# EAGLE schematic n64-usb (EAGLE 5.09)
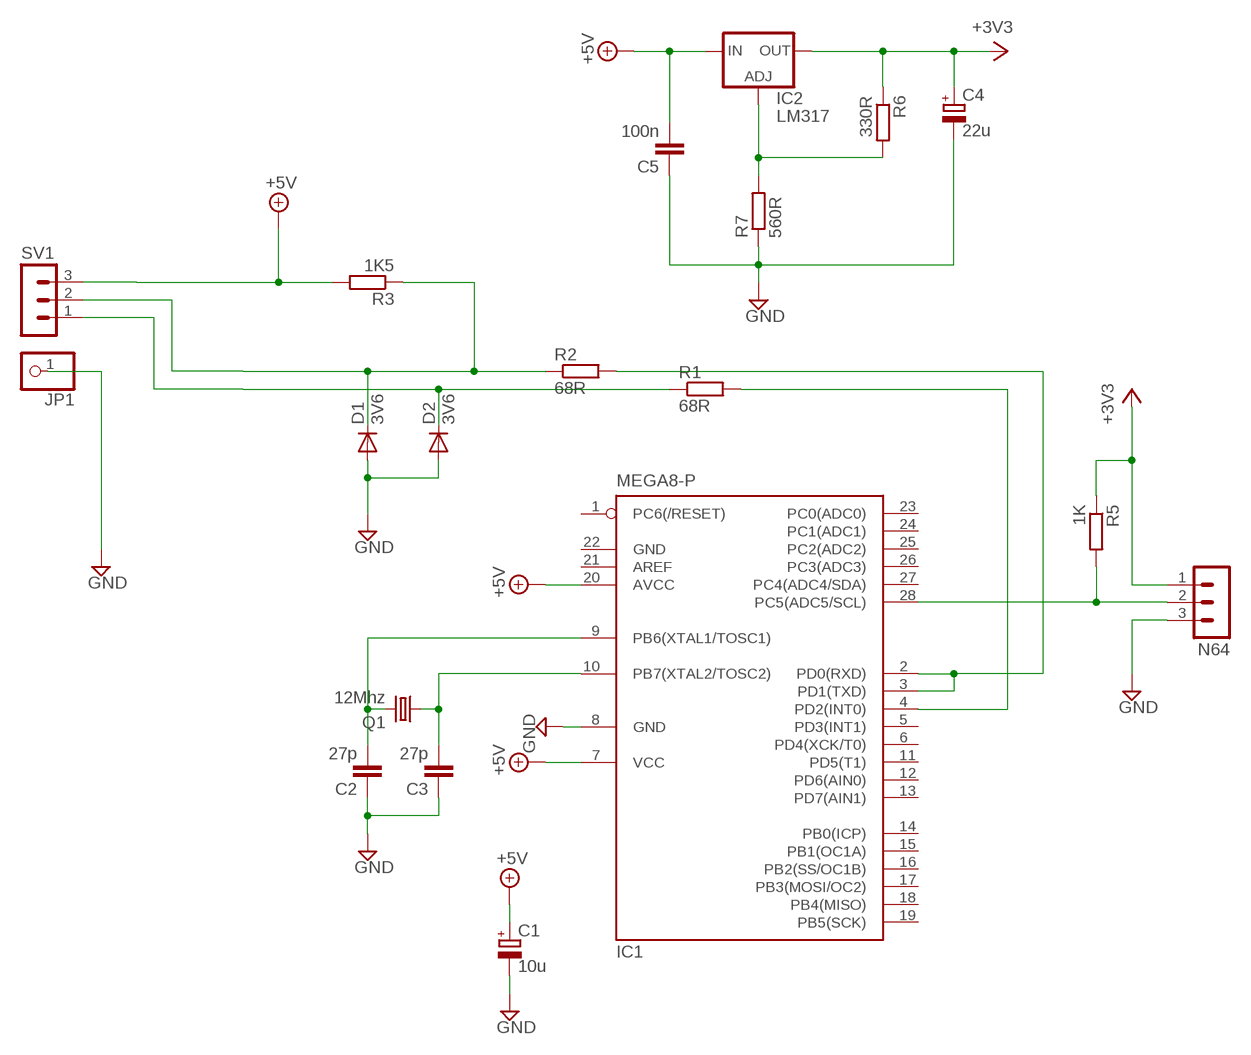
[diagram p0: schematic, sheet 1]

## Parts
C1  10u  CPOL-EUE2.5-6  [E2,5-6]
C2  27p  C-EU025-025X050  [C025-025X050]
C3  27p  C-EU025-025X050  [C025-025X050]
C4  22u  CPOL-EUE2.5-6  [E2,5-6]
C5  100n  C-EU025-025X050  [C025-025X050]
D1  3V6  1N4148DO35-10  [DO35-10]
D2  3V6  1N4148DO35-10  [DO35-10]
IC1  MEGA8-P  [DIL28-3]
IC2  LM317  LM317L  [317L]
JP1  PINHD-1X1  [1X01]
N64  MA03-1  [MA03-1]
Q1  12Mhz  CRYSTALHC49U-V  [HC49U-V]
R1  68R  R-EU_0207/2V  [0207/2V]
R2  68R  R-EU_0207/5V  [0207/5V]
R3  1K5  R-EU_0207/2V  [0207/2V]
R5  1K  R-EU_0207/2V  [0207/2V]
R6  330R  R-EU_0207/2V  [0207/2V]
R7  560R  R-EU_0207/2V  [0207/2V]
SV1  MA03-1  [MA03-1]

## Nets
+3V3: C4.+ IC2.2(OUT) N64.1 R5.1 R6.1
+5V: C1.+ C5.2 IC1.7(VCC) IC1.20(AVCC) IC2.3(IN) R3.2 SV1.3
GND: C1.- C2.1 C3.1 C4.- C5.1 D1.A D2.A IC1.8(GND) JP1.1 N64.3 R7.1
N$1: C3.2 IC1.10(PB7(XTAL2/TOSC2)) Q1.1
N$2: C2.2 IC1.9(PB6(XTAL1/TOSC1)) Q1.2
N$3: IC1.28(PC5(ADC5/SCL)) N64.2 R5.2
N$4: IC1.4(PD2(INT0)) R1.2
N$6: IC1.2(PD0(RXD)) IC1.3(PD1(TXD)) R2.2
N$8: D2.C R1.1 SV1.1
N$9: D1.C R2.1 R3.1 SV1.2
N$11: IC2.1(ADJ) R6.2 R7.2
Unconnected: IC1.1(PC6(/RESET)) IC1.5(PD3(INT1)) IC1.6(PD4(XCK/T0)) IC1.11(PD5(T1)) IC1.12(PD6(AIN0)) IC1.13(PD7(AIN1)) IC1.14(PB0(ICP)) IC1.15(PB1(OC1A)) IC1.16(PB2(SS/OC1B)) IC1.17(PB3(MOSI/OC2)) IC1.18(PB4(MISO)) IC1.19(PB5(SCK)) IC1.21(AREF) IC1.23(PC0(ADC0)) IC1.24(PC1(ADC1)) IC1.25(PC2(ADC2)) IC1.26(PC3(ADC3)) IC1.27(PC4(ADC4/SDA))

## Power pins joined to a net without a drawn wire
GND: IC1.22(GND)

## Library data of the parts
C1 C4 = rcl:CPOL-EU: POLARIZED CAPACITOR, European symbol
C2 C3 C5 = rcl:C-EU: CAPACITOR, European symbol
D1 D2 = diode:1N4148: DIODE high speed (Philips)
IC1 = atmel:MEGA8-P: MICROCONTROLLER 8 Kbytes FLASH, 1 kbytes SRAM, 512 bytes EEPROM, USART, 4-channel 10 bit ADC, 2-channel 8 bit ADC Pin compatible with Atmega48, ATMega88, ATMega168 Source: avr.lbr
IC2 = v-reg:LM317L: VOLTAGE REGULATOR
JP1 = pinhead:PINHD-1X1: PIN HEADER
N64 SV1 = con-lstb:MA03-1: PIN HEADER
Q1 = crystal:CRYSTAL: CRYSTAL
R1-R3 R5-R7 = rcl:R-EU_: RESISTOR, European symbol